# Altium schematic sheet Title page.SchDoc
size A4; SheetNumber: 1; SheetTotal: 4
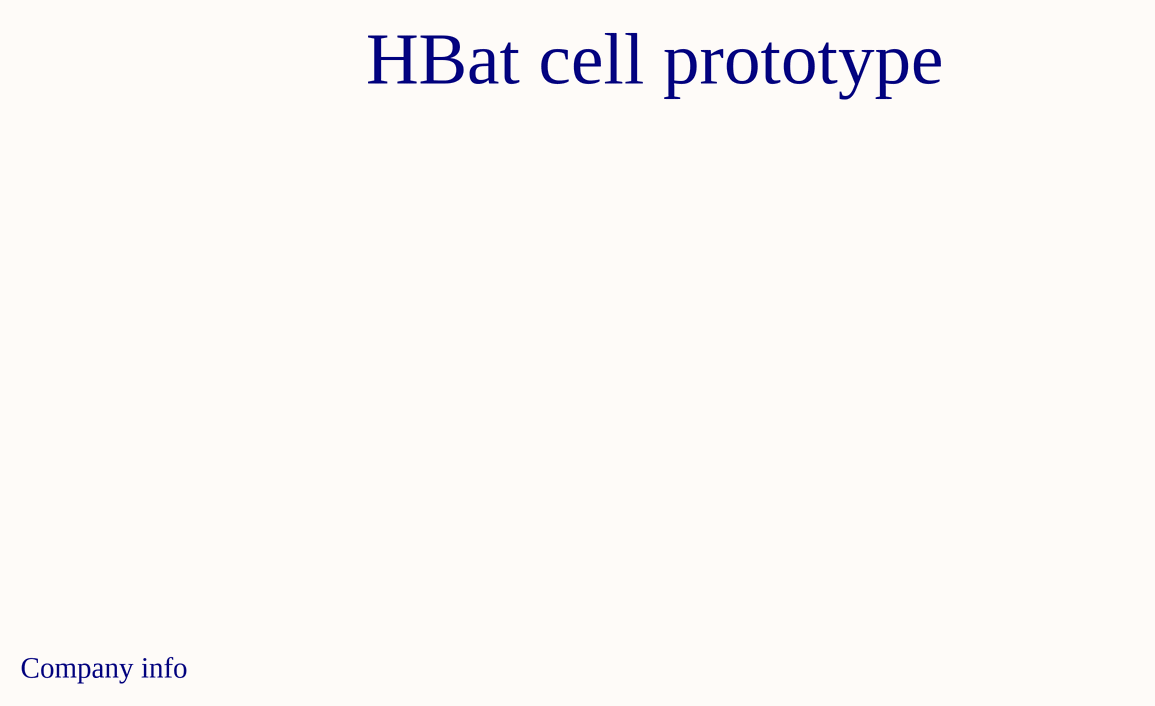
[diagram p0: Title page.SchDoc]

## Notes on the sheet
- HBat cell prototype
- Company info